# Altium project ZUM_Core.PrjPcb (part 1 of 2)
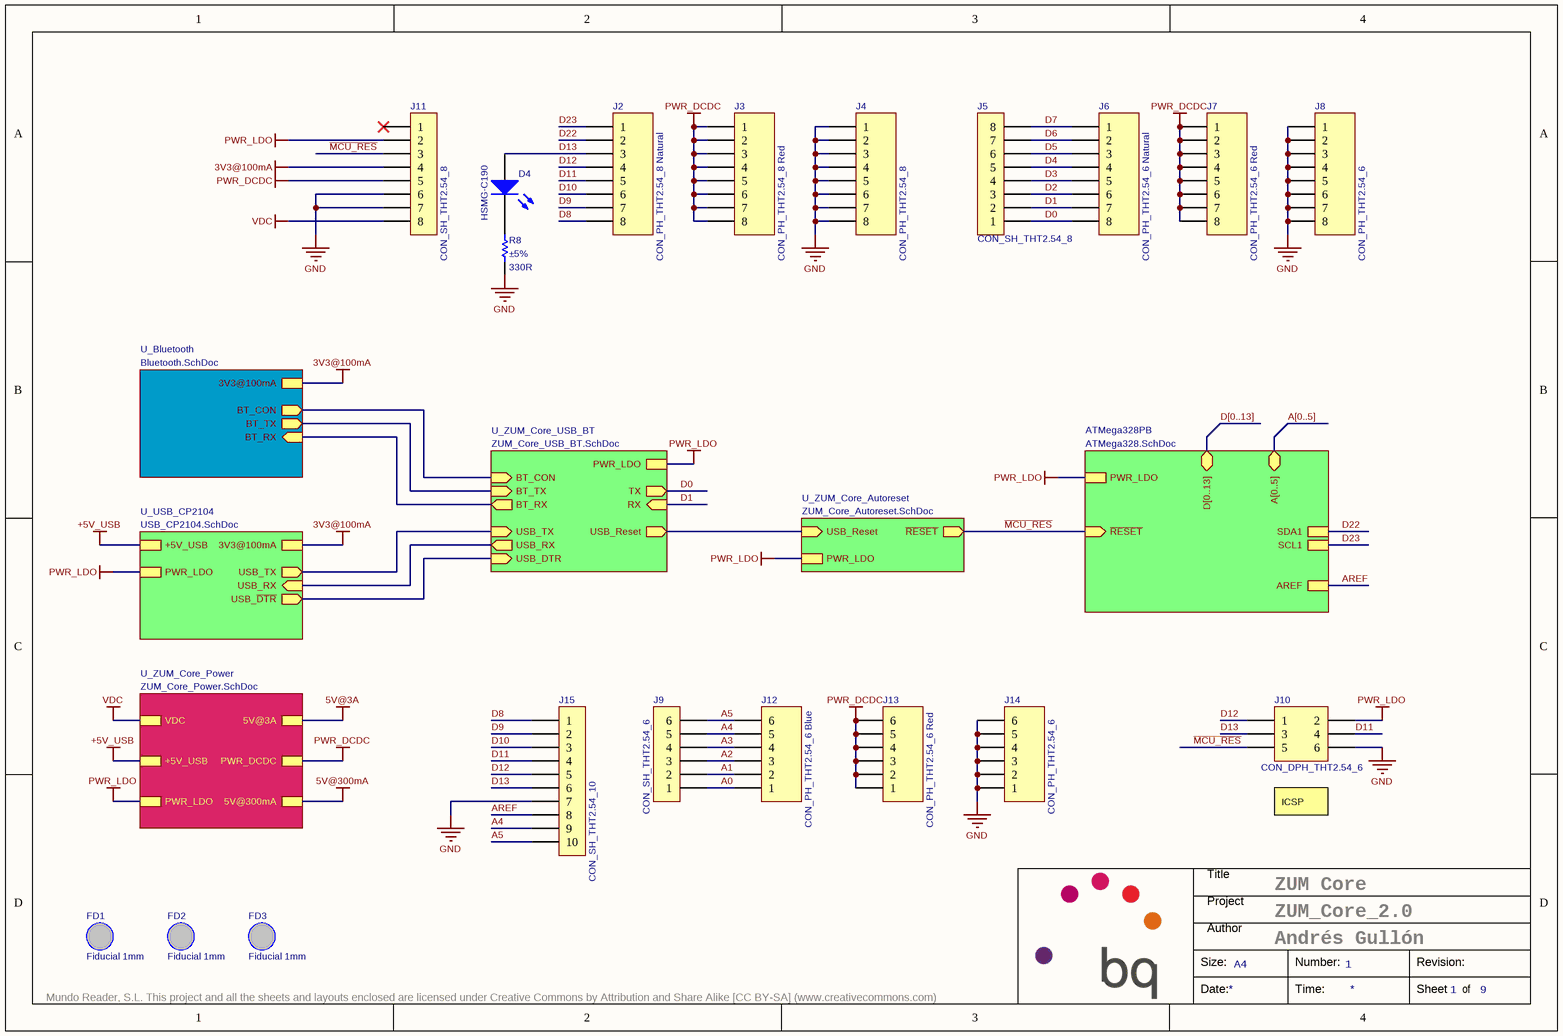
[diagram p0: ZUM_Core.SchDoc]
ItemRevision: 1.I.1; ProjectName: ZUM_Core_2.0; SilkscreenColor: Black; SoldermaskColor: White; SurfaceFinish: HAL / Inmersion TIN / Inmersion Silver
9 sheets, 130 parts. Net scope: hierarchical (ports join the sheet entries above them; power ports are global).
Board file: ZUM_Core.PcbDoc
Sheets:
  ZUM_Core.SchDoc
    ATMega328PB = ATMega328.SchDoc
    U_USB_CP2104 = USB_CP2104.SchDoc
    U_ZUM_Core_Power = ZUM_Core_Power.SchDoc
      U_TPS62133_DCDC_5V = MP1477H_DCDC_5V.SchDoc
      MP2019_LDO_5V = MP2019_LDO_5V.SchDoc
    U_ZUM_Core_USB_BT = ZUM_Core_USB_BT.SchDoc
    U_ZUM_Core_Autoreset = ZUM_Core_Autoreset.SchDoc
    U_Bluetooth = Bluetooth.SchDoc

## Sheet ZUM_Core.SchDoc: ZUM Core
size A4; Author: Andrés Gullón; DocumentNumber: 1; SheetNumber: 1; SheetTotal: 9

### Parts
D4  HSMG-C190  [LED0603]
FD1  Fiducial 1mm  [Fiducial_1mm]  (no BOM)
FD2  Fiducial 1mm  [Fiducial_1mm]  (no BOM)
FD3  Fiducial 1mm  [Fiducial_1mm]  (no BOM)
J2  CON_PH_THT2.54_8 Natural  [1x8 Pin Header 2.54]
J3  CON_PH_THT2.54_8 Red  [1x8 Pin Header 2.54]
J4  CON_PH_THT2.54_8  [1x8 Pin Header 2.54]
J5  CON_SH_THT2.54_8  [1x8 Socket Header THT 2.54mm]
J6  CON_PH_THT2.54_6 Natural  [1x8 Header 2.54 (3D Mod)]
J7  CON_PH_THT2.54_6 Red  [1x8 Header 2.54 (3D Mod)]
J8  CON_PH_THT2.54_6  [1x8 Header 2.54 (3D Mod)]
J9  CON_SH_THT2.54_6  [1x6 Socket Header THT 2.54mm]
J10  CON_DPH_THT2.54_6  [2x3 Pin Header 2.54]
J11  CON_SH_THT2.54_8  [1x8 Socket Header THT 2.54mm]
J12  CON_PH_THT2.54_6 Blue  [1x6 Pin Header 2.54]
J13  CON_PH_THT2.54_6 Red  [1x6 Pin Header 2.54]
J14  CON_PH_THT2.54_6  [1x6 Pin Header 2.54]
J15  CON_SH_THT2.54_10  [1x10 Socket Header THT 2.54mm]
R8  Tolerance: ±5%  Resistance: 330R  [R0402]  (hidden comment: R0402_330R_0.063W_±5%)

### Sub-sheets
ATMega328PB = ATMega328.SchDoc: D[0..13] (bidir), A[0..5] (bidir), ~{RESET} (in), PWR_LDO, AREF, SDA1, SCL1
U_Bluetooth = Bluetooth.SchDoc: 3V3@100mA, BT_TX (out), BT_RX (in), BT_CON (out)
U_USB_CP2104 = USB_CP2104.SchDoc: USB_~{DTR} (out), USB_TX (out), USB_RX (in), +5V_USB, 3V3@100mA, PWR_LDO
U_ZUM_Core_Autoreset = ZUM_Core_Autoreset.SchDoc: ~{RESET} (out), USB_Reset (in), PWR_LDO
U_ZUM_Core_Power = ZUM_Core_Power.SchDoc: VDC, 5V@3A, +5V_USB, PWR_DCDC, 5V@300mA, PWR_LDO
U_ZUM_Core_USB_BT = ZUM_Core_USB_BT.SchDoc: TX (out), RX (in), USB_RX (out), BT_RX (out), USB_TX (in), BT_TX (in), USB_DTR (in), BT_CON (in), PWR_LDO, USB_Reset (out)

### Nets
3V3@100mA: J11.4 ; sheet U_USB_CP2104/3V3@100mA, sheet U_Bluetooth/3V3@100mA
+5V_USB: sheet U_USB_CP2104/+5V_USB, sheet U_ZUM_Core_Power/+5V_USB
GND: J4.1 J4.2 J4.3 J4.4 J4.5 J4.6 J4.7 J4.8 J8.1 J8.2 J8.3 J8.4 J8.5 J8.6 J8.7 J8.8 J10.6 J11.6 J11.7 J14.1 J14.2 J14.3 J14.4 J14.5 J14.6 J15.7 R8.1
PWR_DCDC: J3.1 J3.2 J3.3 J3.4 J3.5 J3.6 J3.7 J3.8 J7.1 J7.2 J7.3 J7.4 J7.5 J7.6 J7.7 J7.8 J11.5 J13.1 J13.2 J13.3 J13.4 J13.5 J13.6 ; sheet U_ZUM_Core_Power/PWR_DCDC
PWR_LDO: J10.2 J11.2 ; sheet ATMega328PB/PWR_LDO, sheet U_USB_CP2104/PWR_LDO, sheet U_ZUM_Core_Power/PWR_LDO, sheet U_ZUM_Core_USB_BT/PWR_LDO, sheet U_ZUM_Core_Autoreset/PWR_LDO
VDC: J11.8 ; sheet U_ZUM_Core_Power/VDC
A0: J9.1 J12.1
A1: J9.2 J12.2
A2: J9.3 J12.3
A3: J9.4 J12.4
A4: J9.5 J12.5 J15.9
A5: J9.6 J12.6 J15.10
AREF: J15.8 ; sheet ATMega328PB/AREF
BT_RX: sheet U_ZUM_Core_USB_BT/BT_RX, sheet U_Bluetooth/BT_RX
BT_TX: sheet U_ZUM_Core_USB_BT/BT_TX, sheet U_Bluetooth/BT_TX
D0: J5.1 J6.8 ; sheet U_ZUM_Core_USB_BT/TX
D1: J5.2 J6.7 ; sheet U_ZUM_Core_USB_BT/RX
D2: J5.3 J6.6
D3: J5.4 J6.5
D4: J5.5 J6.4
D5: J5.6 J6.3
D6: J5.7 J6.2
D7: J5.8 J6.1
D8: J2.8 J15.1
D9: J2.7 J15.2
D10: J2.6 J15.3
D11: J2.5 J10.4 J15.4
D12: J2.4 J10.1 J15.5
D13: D4.A J2.3 J10.3 J15.6
D22: J2.2 ; sheet ATMega328PB/SDA1
D23: J2.1 ; sheet ATMega328PB/SCL1
~{MCU_RES}: J10.5 J11.3 ; sheet ATMega328PB/~{RESET}, sheet U_ZUM_Core_Autoreset/~{RESET}
USB_~{DTR}: sheet U_USB_CP2104/USB_~{DTR}, sheet U_ZUM_Core_USB_BT/USB_DTR
USB_Reset: sheet U_ZUM_Core_USB_BT/USB_Reset, sheet U_ZUM_Core_Autoreset/USB_Reset
USB_RX: sheet U_USB_CP2104/USB_RX, sheet U_ZUM_Core_USB_BT/USB_RX
USB_TX: sheet U_USB_CP2104/USB_TX, sheet U_ZUM_Core_USB_BT/USB_TX
NetD4_K: D4.K R8.2
NetR22_1: sheet U_ZUM_Core_USB_BT/BT_CON, sheet U_Bluetooth/BT_CON

Not connected (* = marked no-connect by the designer): J11 1*

### Buses and harness runs
bus A[0..5] = sheet ATMega328PB/A[0..5]
bus D[0..13] = sheet ATMega328PB/D[0..13]

### Notes on the sheet
- (near J10) ICSP
- Title
- Project
- Size:
- Author
- A4
- Number:
- Revision:
- Mundo Reader, S.L. This project and all the sheets and layouts enclosed are licensed under Creative Commons by Attribution and Share Alike [CC BY-SA] (www.creativecommons.com)
- Date:
- Time:
- Sheet
- of

### Library data of the parts
D4 = CMP-A2544-1: LED; Manufacturer: Avago Technologies; Temp_ Max: 85; Temp_ Min: -40; OrderingCode 2: LG Q971-KN-1; Value: Green; SchLibComponentName: LED; Part Number: HSMG-C190; OrderingCode: HSMG-C190; Description ES: LED; Price units: EUR; Manufacturer 2: OSRAM Opto
FD1-FD3 = CMP-A2525-2: Fiducial; Description ES: Marca fiducial; SchLibComponentName: Fiducial; Part Number: Fiducial 1mm
J2 = CMP-A2144-1: Connector; Manufacturer: Samtec; SchLibComponentName: 1x8 pin Header 2.54mm; Pitch: 2.54mm; OrderingCode: TSW-108-07-T-S-NATURAL; Description ES: Conector; Temp_ Max: 105; Temp_ Min: -55; Part Number: CON_PH_THT2.54_8 Natural; Supplier: Samtec; Supplier cod: AC1238; Price units: EUR
J3 = CMP-A2145-1: Connector; Manufacturer: Samtec; SchLibComponentName: 1x8 pin Header 2.54mm; Pitch: 2.54mm; OrderingCode: TSW-108-07-T-S-RED; Description ES: Conector; Temp_ Max: 105; Temp_ Min: -55; Part Number: CON_PH_THT2.54_8 Red; Supplier: Samtec; Supplier cod: AC1238; Price units: EUR
J4 = CMP-A2142-1: Connector; Manufacturer: Samtec; SchLibComponentName: 1x8 pin Header 2.54mm; Pitch: 2.54mm; OrderingCode: TSW-108-07-T-S; Description ES: Conector; Temp_ Max: 105; Temp_ Min: -55; OrderingCode 2: 613 008 111 21; Value: 8; Part Number: CON_PH_THT2.54_8; Supplier: Samtec; Supplier cod: AC1238; Price units: EUR; Manufacturer 2: Würth Elektronik
J5 J11 = CMP-A2195-1: Connector; Manufacturer: Samtec; Pitch: 2.54mm; OrderingCode: SSW-108-01-T-S; Description ES: Conector; Temp_ Max: 125; Temp_ Min: -40; OrderingCode 2: 613 008 118 21; Value: 8; SchLibComponentName: 1x8 Socket Header 2.54mm; Part Number: CON_SH_THT2.54_8; Supplier: Samtec; Supplier cod: AC1238; Price units: EUR; Manufacturer 2: Würth Elektronik
J6 = CMP-00382-1: Connector; Manufacturer: Samtec; SchLibComponentName: 1x6 pin Header 2.54mm; Pitch: 2.54mm; OrderingCode: TSW-106-07-T-S-NATURAL; Description ES: Conector; Temp_ Max: 105; Temp_ Min: -55; Part Number: CON_PH_THT2.54_6 Natural; Supplier: Samtec; Supplier cod: AC1238; Price units: EUR
J7 = CMP-00380-2: Connector; Manufacturer: Samtec; SchLibComponentName: 1x6 pin Header 2.54mm; Pitch: 2.54mm; OrderingCode: TSW-106-07-T-S-RED; Description ES: Conector; Temp_ Max: 105; Temp_ Min: -55; Part Number: CON_PH_THT2.54_6 Red; Supplier: Samtec; Supplier cod: AC1238; Price units: EUR
J8 = CMP-00381-1: Connector; Manufacturer: Samtec; SchLibComponentName: 1x6 pin Header 2.54mm; Pitch: 2.54mm; OrderingCode: TSW-106-07-T-S; Description ES: Conector; Temp_ Max: 105; Temp_ Min: -55; OrderingCode 2: 613 006 111 21; Value: 6; Part Number: CON_PH_THT2.54_6; Supplier: Samtec; Supplier cod: AC1238; Price units: EUR; Manufacturer 2: Würth Elektronik
J9 = CMP-A2194-1: Connector; Manufacturer: Samtec; Pitch: 2.54mm; OrderingCode: SSW-106-01-T-S; Description ES: Conector; Temp_ Max: 125; Temp_ Min: -40; OrderingCode 2: 613 006 118 21; Value: 6; SchLibComponentName: 1x6 Socket Header 2.54mm; Part Number: CON_SH_THT2.54_6; Supplier: Samtec; Supplier cod: AC1238; Price units: EUR; Manufacturer 2: Würth Elektronik
J10 = CMP-A2163-1: Connector; Manufacturer: Samtec; SchLibComponentName: 2x3 pin Header 2.54mm; Pitch: 2.54mm; OrderingCode: TSW-103-07-T-D; Description ES: Conector; Temp_ Max: 125; Temp_ Min: -40; OrderingCode 2: 613 006 211 21; Value: 6; Part Number: CON_DPH_THT2.54_6; Supplier: Samtec; Supplier cod: AC1238; Price units: EUR; Manufacturer 2: Würth Elektronik
J12 = CMP-A2139-1: Connector; Manufacturer: Samtec; SchLibComponentName: 1x6 pin Header 2.54mm; Pitch: 2.54mm; OrderingCode: TSW-106-07-T-S-BLUE; Description ES: Conector; Temp_ Max: 105; Temp_ Min: -55; Part Number: CON_PH_THT2.54_6 Blue; Supplier: Samtec; Supplier cod: AC1238; Price units: EUR
J13 = CMP-A2141-1: Connector; Manufacturer: Samtec; SchLibComponentName: 1x6 pin Header 2.54mm; Pitch: 2.54mm; OrderingCode: TSW-106-07-T-S-RED; Description ES: Conector; Temp_ Max: 105; Temp_ Min: -55; Part Number: CON_PH_THT2.54_6 Red; Supplier: Samtec; Supplier cod: AC1238; Price units: EUR
J14 = CMP-A2138-1: Connector; Manufacturer: Samtec; SchLibComponentName: 1x6 pin Header 2.54mm; Pitch: 2.54mm; OrderingCode: TSW-106-07-T-S; Description ES: Conector; Temp_ Max: 105; Temp_ Min: -55; OrderingCode 2: 613 006 111 21; Value: 6; Part Number: CON_PH_THT2.54_6; Supplier: Samtec; Supplier cod: AC1238; Price units: EUR; Manufacturer 2: Würth Elektronik
J15 = CMP-A2189-1: Connector; Manufacturer: Samtec; Pitch: 2.54mm; OrderingCode: SSW-110-01-T-S; Description ES: Conector; Temp_ Max: 125; Temp_ Min: -40; Value: 10; OrderingCode 2: 613 010 118 21; SchLibComponentName: 1x10 Socket Header 2.54mm; Part Number: CON_SH_THT2.54_10; Supplier: Samtec; Supplier cod: AC1238; Price units: EUR; Manufacturer 2: Würth Elektronik
R8 = CMP-A1762-2: Manufacturer: Vishay; SchLibComponentName: Resistor; OrderingCode: CRCW0402330RJN; Power: 0.063W; Value: 330R ±5% 0.063W; Temp_ Max: 155; Temp_ Min: -55; Description ES: Resistencia; PackageDescription: SMD; Part Number: R0402_330R_0.063W_±5%; Price units: EUR

## Sheet ATMega328.SchDoc: ATMega328-PB
size A4; Author: Andrés Gullón; DocumentNumber: 6; SheetNumber: 6; SheetTotal: 9
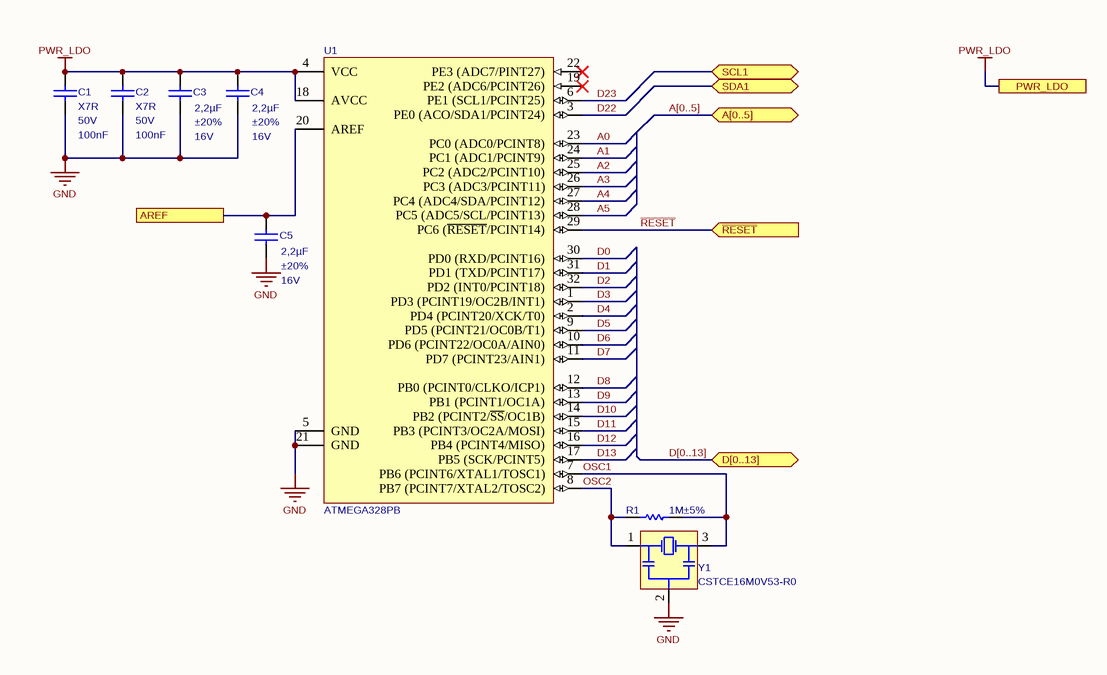
[diagram p1: ATMega328.SchDoc]

### Parts
C1  Dielectric: X7R  Voltage: 50V  Capacitance: 100nF  [C0603]  (hidden comment: C0603_100nF_50V_±10%_X7R)
C2  Dielectric: X7R  Voltage: 50V  Capacitance: 100nF  [C0603]  (hidden comment: C0603_100nF_50V_±10%_X7R)
C3  Voltage: 16V  Capacitance: 2,2µF  Tolerance: ±20%  [C0402]  (hidden comment: C0402_2.2uF_16V_±20%)
C4  Voltage: 16V  Capacitance: 2,2µF  Tolerance: ±20%  [C0402]  (hidden comment: C0402_2.2uF_16V_±20%)
C5  Voltage: 16V  Capacitance: 2,2µF  Tolerance: ±20%  [C0402]  (hidden comment: C0402_2.2uF_16V_±20%)
R1  Tolerance: ±5%  Resistance: 1M  [R0603]  (hidden comment: R0603_1M_0.1W_±5%)
U1  ATMEGA328PB  [TQFP32]
Y1  CSTCE16M0V53-R0  [Resonator_1.3x3.2]

### Ports
A[0..5] (bidir), AREF, D[0..13] (bidir), PWR_LDO, SCL1 (bidir), SDA1 (bidir), ~{RESET} (in)

### Nets
GND: C1.1 C2.1 C3.1 C4.1 C5.1 U1.5(GND) U1.21(GND) Y1.2(GND)
PWR_LDO: C1.2 C2.2 C3.2 C4.2 U1.4(VCC) U1.18(AVCC) ; port PWR_LDO
A0: U1.23(PC0_(ADC0/PCINT8))
A1: U1.24(PC1_(ADC1/PCINT9))
A2: U1.25(PC2_(ADC2/PCINT10))
A3: U1.26(PC3_(ADC3/PCINT11))
A4: U1.27(PC4_(ADC4/SDA/PCINT12))
A5: U1.28(PC5_(ADC5/SCL/PCINT13))
AREF: C5.2 U1.20(AREF) ; port AREF
D0: U1.30(PD0_(RXD/PCINT16))
D1: U1.31(PD1_(TXD/PCINT17))
D2: U1.32(PD2_(INT0/PCINT18))
D3: U1.1(PD3_(PCINT19/OC2B/INT1))
D4: U1.2(PD4_(PCINT20/XCK/T0))
D5: U1.9(PD5_(PCINT21/OC0B/T1))
D6: U1.10(PD6_(PCINT22/OC0A/AIN0))
D7: U1.11(PD7_(PCINT23/AIN1))
D8: U1.12(PB0_(PCINT0/CLKO/ICP1))
D9: U1.13(PB1_(PCINT1/OC1A))
D10: U1.14(PB2_(PCINT2/~{SS}/OC1B))
D11: U1.15(PB3_(PCINT3/OC2A/MOSI))
D12: U1.16(PB4_(PCINT4/MISO))
D13: U1.17(PB5_(SCK/PCINT5))
D22: U1.3(PE0_(ACO/SDA1/PCINT24)) ; port SDA1
D23: U1.6(PE1_(SCL1/PCINT25)) ; port SCL1
OSC1: R1.1 U1.7(PB6_(PCINT6/XTAL1/TOSC1)) Y1.3(OSC2)
OSC2: R1.2 U1.8(PB7_(PCINT7/XTAL2/TOSC2)) Y1.1(OSC1)
~{RESET}: U1.29(PC6_(~{RESET}/PCINT14)) ; port ~{RESET}  [project net ~{MCU_RES}]

Not connected (* = marked no-connect by the designer): U1 19(PE2_(ADC6/PCINT26))* 22(PE3_(ADC7/PINT27))*

### Buses and harness runs
bus A[0..5] = port A[0..5]
bus D[0..13] = port D[0..13]

### Notes on the sheet
- Title
- Project
- Size:
- Author
- A4
- Number:
- Revision:
- Mundo Reader, S.L. This project and all the sheets and layouts enclosed are licensed under Creative Commons by Attribution and Share Alike [CC BY-SA] (www.creativecommons.com)
- Date:
- Time:
- Sheet
- of

### Library data of the parts
C1 C2 = CMP-00257-1: Manufacturer: Kemet; Description ES: Condensador; OrderingCode: C0603C104K5RAC; OrderingCode 2: 06035C104KAT2A; SchLibComponentName: Capacitor; Temp_ Max: 125; Temp_ Min: -55; Tolerance: ±10%; Value: 100nF ±10% 50V; Manufacturer 2: AVX; Part Number: C0603_100nF_50V_±10%_X7R; Price units: EUR
C3-C5 = CMP-A0550-4: C0402_2.2uF_16V_±20%_X5R; Part Number: C0402_2.2uF_16V_±10%; Manufacturer: TDK; Value: 2,2µF ±20% 16V; Dielectric: X5R; OrderingCode: C1005X5R1C225M050BC; Temp_ Max: 125; Temp_ Min: -55; AccessRights: 2147483647; ContentType: Component; Description ES: Condensador; Folder: Components Library\Pasives\Capacitor_SMD\C0402_16V$\; OrderingCode 2: EMK105ABJ225MV-F; RevisionId: 3; SchLibComponentName: Capacitor; Price units: EUR; ComponentType: Capacitor; ContentTypeGUID: CB3C11C4-E317-11DF-B822-12313F0024A2; FolderGUID: B1BE7916-43F7-4918-A273-F24409A7170B; ItemGUID: BD471B44-C1FF-4F80-85CC-AC0CC62DE9EE; ItemHRID: CMP-A0550; LifeCycle: New From Design; LifeCycleStateGUID: 706004B5-C76E-482E-903B-BA0E4FAE086A; Manufacturer 2: Taiyo Yuden; ReleaseDate: 04/09/2017 08:02:11 AM
R1 = CMP-A1358-3: Manufacturer: Vishay; OrderingCode: CRCW06031M00JN; Power: 0.1W; Value: 1M ±5% 0.1W; Temp_ Max: 155; Temp_ Min: -55; Description ES: Resistencia; SchLibComponentName: Resistor; PackageDescription: SMD; Part Number: R0603_1M_0.1W_±5%; Price units: EUR
U1 = CMP-00141-3: 8-bit Microcontrollers - MCU 32KB In-system Flash 20MHz 1.8V-5.5V; Manufacturer: Atmel; OrderingCode: ATMEGA328PB-AU; Description ES: Microcontrolador 8 bits; 32kB de memoria; Temp_ Max: 85; Temp_ Min: -40; SchLibComponentName: ATMEGA328PB; Part Number: ATMEGA328PB; Price units: EUR
Y1 = CMP-A2241-1: Resonator 16MHz; Manufacturer: Murata; Description ES: Resonador 16MHz; Temp_Max: 80; Temp_Min: -20; SchLibComponentName: Resonator 3 pin; Part Number: CSTCE16M0V53-R0; OrderingCode: CSTCE16M0V53-R0; Price units: EUR; Value: 16MHz

## Sheet USB_CP2104.SchDoc: CP2104 USB to Serial
size A4; Author: Andrés Gullón; DocumentNumber: 5; SheetNumber: 5; SheetTotal: 9
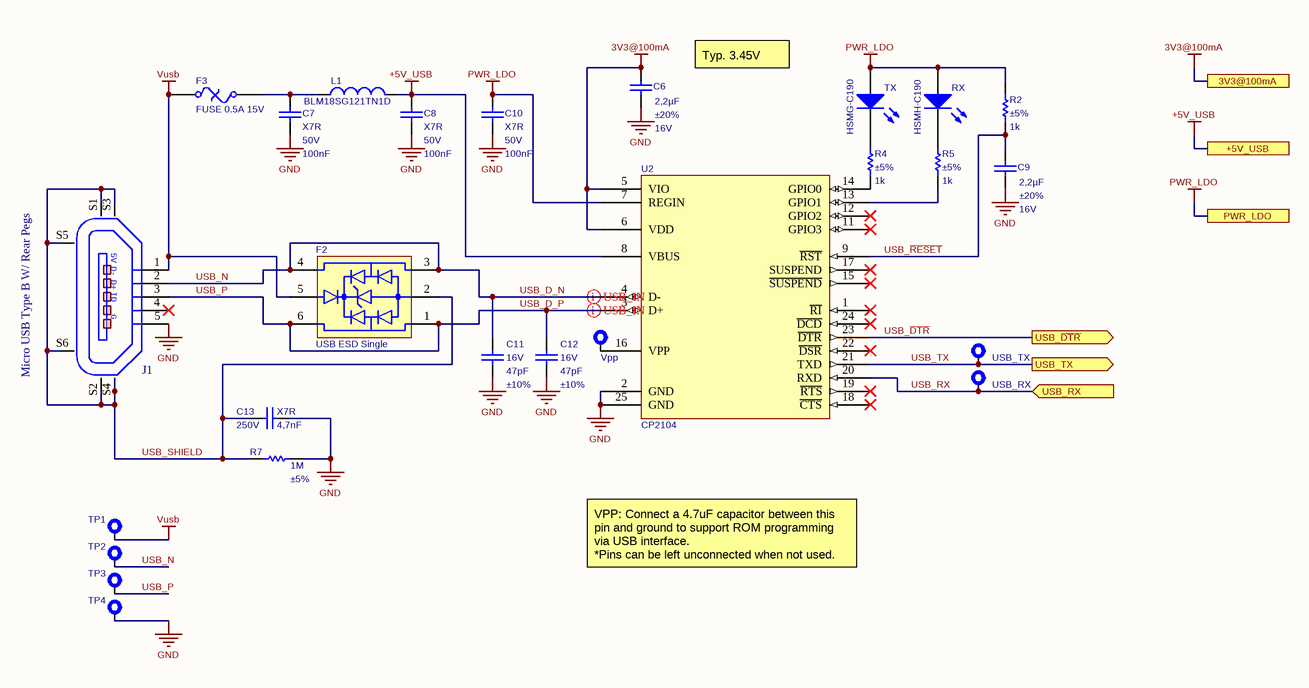
[diagram p2: USB_CP2104.SchDoc]

### Parts
C6  Voltage: 16V  Capacitance: 2,2µF  Tolerance: ±20%  [C0402]  (hidden comment: C0402_2.2uF_16V_±20%)
C7  Dielectric: X7R  Voltage: 50V  Capacitance: 100nF  [C0603]  (hidden comment: C0603_100nF_50V_±10%_X7R)
C8  Dielectric: X7R  Voltage: 50V  Capacitance: 100nF  [C0603]  (hidden comment: C0603_100nF_50V_±10%_X7R)
C9  Voltage: 16V  Capacitance: 2,2µF  Tolerance: ±20%  [C0402]  (hidden comment: C0402_2.2uF_16V_±20%)
C10  Dielectric: X7R  Voltage: 50V  Capacitance: 100nF  [C0603]  (hidden comment: C0603_100nF_50V_±10%_X7R)
C11  Voltage: 16V  Capacitance: 47pF  Tolerance: ±10%  [C0402]  (hidden comment: C0402_47pF_16V_±10%)
C12  Voltage: 16V  Capacitance: 47pF  Tolerance: ±10%  [C0402]  (hidden comment: C0402_47pF_16V_±10%)
C13  Dielectric: X7R  Voltage: 250V  Capacitance: 4,7nF  [C0805]  (hidden comment: C0805_4700pF_250V_±10%_X7R)
F2  USB ESD Single  [SOT563]
F3  FUSE 0.5A 15V  [F1812]
J1  Micro USB Type B W/ Rear Pegs  [USB_B_W_REAR_PEGS]
L1  OrderingCode: BLM18SG121TN1D  [L0603]  (hidden comment: L0603_120R_0,025R_3000mA)
R2  Tolerance: ±5%  Resistance: 1k  [R0402]  (hidden comment: R0402_1k_0.063W_±5%)
R4  Tolerance: ±5%  Resistance: 1k  [R0402]  (hidden comment: R0402_1k_0.063W_±5%)
R5  Tolerance: ±5%  Resistance: 1k  [R0402]  (hidden comment: R0402_1k_0.063W_±5%)
R7  Tolerance: ±5%  Resistance: 1M  [R0603]  (hidden comment: R0603_1M_0.1W_±5%)
RX  HSMH-C190  [LED0603]
TP1  TP  [TP_POWER]  (value not drawn)  (no BOM)
TP2  TP_POWER  [TP_POWER]  (value not drawn)  (no BOM)
TP3  TP_POWER  [TP_POWER]  (value not drawn)  (no BOM)
TP4  TP_POWER  [TP_POWER]  (value not drawn)  (no BOM)
TX  HSMG-C190  [LED0603]
U2  CP2104  [QFN24_no_power]
USB_RX  TP_POWER  [TP_POWER]  (value not drawn)  (no BOM)
USB_TX  TP_POWER  [TP_POWER]  (value not drawn)  (no BOM)
Vpp  TP_POWER  [TP_POWER]  (value not drawn)  (no BOM)

### Ports
3V3@100mA, +5V_USB, PWR_LDO, USB_RX (in), USB_TX (out), USB_~{DTR} (out)

### Nets
3V3@100mA: C6.2 U2.5(VIO) U2.6(VDD) ; port 3V3@100mA
+5V_USB: C8.2 L1.2 U2.8(VBUS) ; port +5V_USB
GND: C6.1 C7.1 C8.1 C9.1 C10.1 C11.1 C12.1 C13.2 J1.5(P5) R7.1 TP4.1 U2.2(GND) U2.25(GND)
PWR_LDO: C10.2 R2.2 RX.A TX.A U2.7(REGIN) ; port PWR_LDO
Vusb: F2.5 F3.1 J1.1(P1) TP1.1
USB_~{DTR}: U2.23(~{DTR}) ; port USB_~{DTR}
USB_D_N: C11.2 F2.3 F2.4 J1.2(P2) TP2.1 U2.4(D-)  [also labelled USB_N]
USB_D_P: C12.2 F2.1 F2.6 J1.3(P3) TP3.1 U2.3(D+)  [also labelled USB_P]
USB_~{RESET}: C9.2 R2.1 U2.9(~{RST})
USB_RX: U2.20(RXD) USB_RX.1 ; port USB_RX
USB_SHIELD: C13.1 F2.2 J1.S1(SHLD1) J1.S2(SHLD2) J1.S3(SHLD3) J1.S4(SHLD4) J1.S5(SHLD5) J1.S6(SHLD6) R7.2
USB_TX: U2.21(TXD) USB_TX.1 ; port USB_TX
NetC7_2: C7.2 F3.2 L1.1
NetR4_1: R4.1 U2.14(GPIO0)
NetR4_2: R4.2 TX.K
NetR5_1: R5.1 U2.13(GPIO1)
NetR5_2: R5.2 RX.K
NetU2_16: U2.16(VPP) Vpp.1

Not connected (* = marked no-connect by the designer): J1 4(P4)*; U2 1(~{RI})* 11(GPIO3)* 12(GPIO2)* 15(~{SUSPEND})* 17(SUSPEND)* 18(~{CTS})* 19(~{RTS})* 22(~{DSR})* 24(~{DCD})*

### Layout directives
differential pair: USB_D_N, USB_D_P

### Notes on the sheet
- Typ. 3.45V
- VPP: Connect a 4.7uF capacitor between this pin and ground to support ROM programming via USB interface.
  *Pins can be left unconnected when not used.
- Title
- Project
- Size:
- Author
- A4
- Number:
- Revision:
- Mundo Reader, S.L. This project and all the sheets and layouts enclosed are licensed under Creative Commons by Attribution and Share Alike [CC BY-SA] (www.creativecommons.com)
- Date:
- Time:
- Sheet
- of
- (in symbol CMP-A2224-4) 5V; D-; D+; ID; G

### Library data of the parts
C6 C9 = CMP-A0550-4: as C3 on sheet ATMega328; SchLibComponentName: Capacitor; Price units: EUR; ComponentType: Capacitor; ContentTypeGUID: CB3C11C4-E317-11DF-B822-12313F0024A2; FolderGUID: B1BE7916-43F7-4918-A273-F24409A7170B; ItemGUID: BD471B44-C1FF-4F80-85CC-AC0CC62DE9EE; ItemHRID: CMP-A0550; LifeCycle: New From Design; LifeCycleStateGUID: 706004B5-C76E-482E-903B-BA0E4FAE086A; Manufacturer 2: Taiyo Yuden; ReleaseDate: 04/09/2017 08:02:11 AM
C7 C8 C10 = CMP-00257-1: as C1 on sheet ATMega328; Manufacturer 2: AVX; Part Number: C0603_100nF_50V_±10%_X7R; Price units: EUR
C11 C12 = CMP-A0572-2: Manufacturer: Kemet; Value: 47pF ±10% 16V; Dielectric: C0G; OrderingCode: C0402C470K4GAC; Temp_ Max: 125; Temp_ Min: -55; AccessRights: 2147483647; ContentType: Component; Description ES: Condensador; Folder: Components Library\Pasives\Capacitor_SMD\C0402_16V$\; RevisionId: 1; SchLibComponentName: Capacitor; Part Number: C0402_47pF_16V_±10%; Price units: EUR; ComponentType: Capacitor; ContentTypeGUID: CB3C11C4-E317-11DF-B822-12313F0024A2; FolderGUID: B1BE7916-43F7-4918-A273-F24409A7170B; ItemGUID: BA17F97B-A8F2-4344-A89B-4AB43394B9E9; ItemHRID: CMP-A0572; LifeCycle: New From Design; LifeCycleStateGUID: 706004B5-C76E-482E-903B-BA0E4FAE086A; ReleaseDate: 19/02/2016 10:21:00 AM
C13 = CMP-00357-1: Manufacturer: Kemet; Description ES: Condensador; OrderingCode: C0805S472KARACTU; OrderingCode 2: GRM21AR72E472KW01D; SchLibComponentName: Capacitor; Temp_ Max: 125; Temp_ Min: -55; Tolerance: ±10%; Value: 4,7nF ±10% 250V; Manufacturer 2: Murata; Price units: EUR
F2 = CMP-A2443-2: TVS Diode Array; Manufacturer: Würth Elektronik; OrderingCode: 82400152; Description ES: Array de diodos TVS; Temp_ Max: 125; Temp_ Min: -40; OrderingCode 2: CDSOT563-0502; SchLibComponentName: ESDUSB; Part Number: USB ESD Single; Supplier: Würth Elektronik; Price units: EUR; Manufacturer 2: Bourns
F3 = CMP-A2421-1: Resettable Fuses; Manufacturer: Bourns; OrderingCode: MF-MSMF050-2; Description ES: Fusible reseteable; Temp_ Max: 85; Temp_ Min: -40; SchLibComponentName: PTC_Fuse; Part Number: FUSE 0.5A 15V; Voltage: 15V; Current: 0.5A; Price units: EUR
J1 = CMP-A2224-4: Manufacturer: FCI; OrderingCode: 10118194-0001LF; Description ES: Conector; Temp_ Max: 105; Temp_ Min: -40; SchLibComponentName: USB_Micro_Type_B; Part Number: Micro USB Type B W/ Rear Pegs; Price units: EUR
L1 = CMP-A0708-2: Manufacturer: Murata; Resistance_100MHz: 120R; Resistance_DC: 0,025R; Current: 3000mA; Temp_ Max: 125; Temp_ Min: -55; Value: 120R 0,025R 3000mA; Description ES: Ferrita; SchLibComponentName: Ferrite Bead; Part Number: L0603_120R_0,025R_3000mA; Price units: EUR
R2 R4 R5 = CMP-A1718-3: Manufacturer: Vishay; OrderingCode: CRCW04021K00JN; Power: 0.063W; Value: 1k ±5% 0.063W; Temp_ Max: 155; Temp_ Min: -55; Description ES: Resistencia; SchLibComponentName: Resistor; PackageDescription: SMD; Part Number: R0402_1k_0.063W_±5%; Price units: EUR
R7 = CMP-A1358-3: as R1 on sheet ATMega328; SchLibComponentName: Resistor; PackageDescription: SMD; Part Number: R0603_1M_0.1W_±5%; Price units: EUR
RX = CMP-A2546-1: LED; Manufacturer: Avago Technologies; Temp_ Max: 85; Temp_ Min: -40; OrderingCode 2: LS Q976-NR-1; Value: Red; SchLibComponentName: LED; Part Number: HSMH-C190; OrderingCode: HSMH-C190; Description ES: LED; Price units: EUR; Manufacturer 2: OSRAM Opto
TP1-TP4 USB_RX USB_TX Vpp = CMP-A2499-3: Testpoint 0.3mm; Manufacturer: Oxley; OrderingCode: SMOX/060/B1; SAP: 303552; SchLibComponentName: Testpoint; Part Number: TP_POWER; Price units: EUR
TX = CMP-A2544-1: as D4 on sheet ZUM_Core; SchLibComponentName: LED; Part Number: HSMG-C190; OrderingCode: HSMG-C190; Description ES: LED; Price units: EUR; Manufacturer 2: OSRAM Opto
U2 = CMP-A2587-1: USB to UART Bridge; Manufacturer: Silicon Labs; OrderingCode: CP2104-F03-GMR; Description ES: Interfaz USB a UART; Temp_ Max: 85; Temp_ Min: -40; SchLibComponentName: CP2104; Part Number: CP2104; Supplier: Silica; Supplier cod: AC1190; Price units: EUR

## Sheet ZUM_Core_Power.SchDoc: ZUM Core Power
size A4; Author: Andrés Gullón; DocumentNumber: 2; SheetNumber: 2; SheetTotal: 9
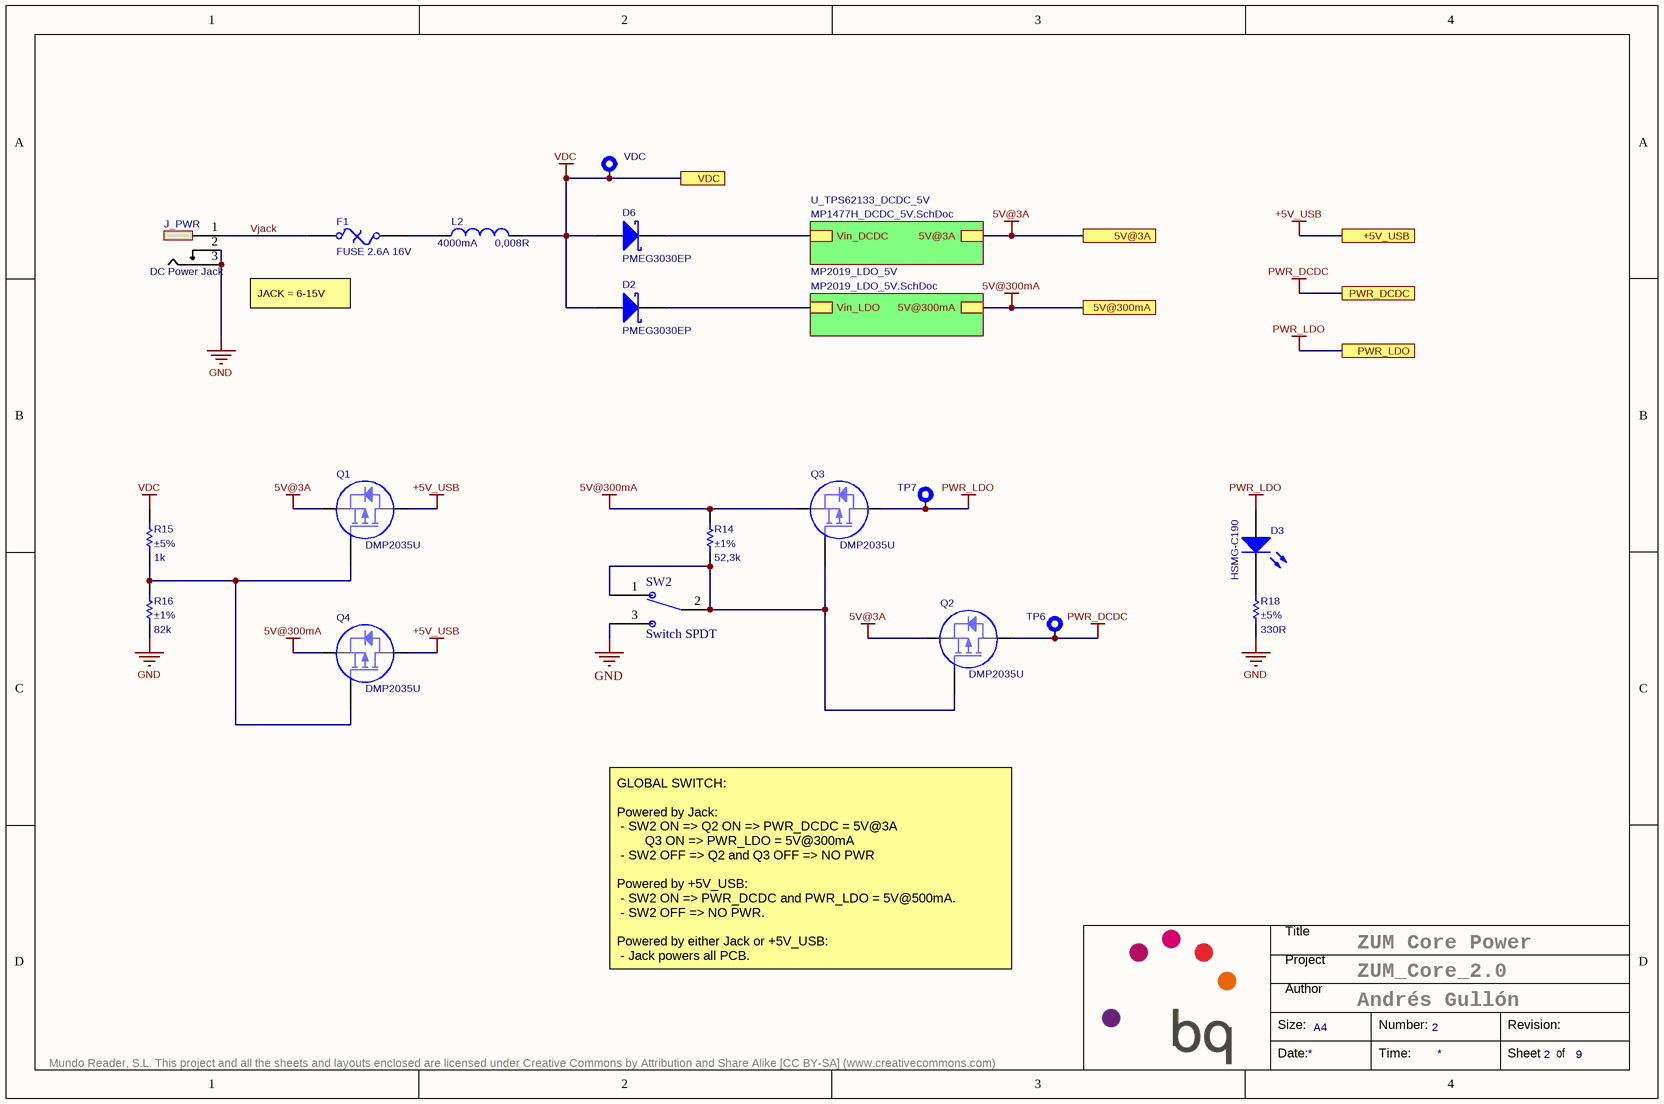
[diagram p3: ZUM_Core_Power.SchDoc]

### Parts
D2  PMEG3030EP  [SOD128]
D3  HSMG-C190  [LED0603]
D6  PMEG3030EP  [SOD128]
F1  FUSE 2.6A 16V  [F1812]
J_PWR  DC Power Jack  [Jack 2.1]
L2  Resistance_DC: 0,008R  Current: 4000mA  [L0805]  (hidden comment: L0805_33R_0,008R_4000mA)
Q1  DMP2035U  [SOT23-3]
Q2  DMP2035U  [SOT23-3]
Q3  DMP2035U  [SOT23-3]
Q4  DMP2035U  [SOT23-3]
R14  Tolerance: ±1%  Resistance: 52,3k  [R0402]  (hidden comment: R0402_52,3k_0.063W_±1%)
R15  Tolerance: ±5%  Resistance: 1k  [R0402]  (hidden comment: R0402_1k_0.063W_±5%)
R16  Tolerance: ±1%  Resistance: 82k  [R0402]  (hidden comment: R0402_82k_0.063W_±1%)
R18  Tolerance: ±5%  Resistance: 330R  [R0402]  (hidden comment: R0402_330R_0.063W_±5%)
SW2  Switch SPDT  [Slide SW SPDT Right Angle]
TP6  TP  [TP_POWER]  (value not drawn)  (no BOM)
TP7  TP  [TP_POWER]  (value not drawn)  (no BOM)
VDC  TP_POWER  [TP_POWER]  (value not drawn)  (no BOM)

### Sub-sheets
MP2019_LDO_5V = MP2019_LDO_5V.SchDoc: 5V@300mA, Vin_LDO
U_TPS62133_DCDC_5V = MP1477H_DCDC_5V.SchDoc: Vin_DCDC, 5V@3A

### Ports
5V@3A, 5V@300mA, +5V_USB, PWR_DCDC, PWR_LDO, VDC

### Nets
5V@3A: Q1.2(S) Q2.2(S) ; port 5V@3A, sheet U_TPS62133_DCDC_5V/5V@3A
5V@300mA: Q3.2(S) Q4.2(S) R14.1 ; port 5V@300mA, sheet MP2019_LDO_5V/5V@300mA
+5V_USB: Q1.3(D) Q4.3(D) ; port +5V_USB
GND: J_PWR.2 J_PWR.3 R16.1 R18.1 SW2.3
PWR_DCDC: Q2.3(D) TP6.1 ; port PWR_DCDC
PWR_LDO: D3.A Q3.3(D) TP7.1 ; port PWR_LDO
VDC: D2.A D6.A L2.2 R15.2 VDC.1 ; port VDC
Vin_DCDC: D6.k(K) ; sheet U_TPS62133_DCDC_5V/Vin_DCDC
Vjack: F1.1 J_PWR.1
NetC31_1: D2.k(K) ; sheet MP2019_LDO_5V/Vin_LDO
NetD3_K: D3.K R18.2
NetF1_2: F1.2 L2.1
NetQ1_1: Q1.1(G) Q4.1(G) R15.1 R16.2
NetQ2_1: Q2.1(G) Q3.1(G) R14.2 SW2.1 SW2.2

### Notes on the sheet
- JACK = 6-15V
- GLOBAL SWITCH:
  Powered by Jack:
  - SW2 ON => Q2 ON => PWR_DCDC = 5V@3A
  Q3 ON => PWR_LDO = 5V@300mA
  - SW2 OFF => Q2 and Q3 OFF => NO PWR
  Powered by +5V_USB:
  - SW2 ON => PWR_DCDC and PWR_LDO = 5V@500mA.
  - SW2 OFF => NO PWR.
  Powered by either Jack or +5V_USB:
  - Jack powers all PCB.
- Title
- Project
- Size:
- Author
- A4
- Number:
- Revision:
- Mundo Reader, S.L. This project and all the sheets and layouts enclosed are licensed under Creative Commons by Attribution and Share Alike [CC BY-SA] (www.creativecommons.com)
- Date:
- Time:
- Sheet
- of

### Library data of the parts
D2 D6 = CMP-A2309-1: Schottky Diode; Manufacturer: NXP; Ifor: 3A; Vrrm: 30V; Ifsm: 50A; Vf: 0,36V; Description ES: Diodo Schottky; Temp_Max: 150; Temp_Min: -55; Value: 3A 30V; SchLibComponentName: Schottky; Part Number: PMEG3030EP; OrderingCode: PMEG3030EP; Price units: EUR
D3 = CMP-A2544-1: as D4 on sheet ZUM_Core; SchLibComponentName: LED; Part Number: HSMG-C190; OrderingCode: HSMG-C190; Description ES: LED; Price units: EUR; Manufacturer 2: OSRAM Opto
F1 = CMP-A2427-2: Resettable Fuses; Part Number: FUSE 2.5A 16V; Manufacturer: Bel Fuse; SchLibComponentName: PTC_Fuse; Current: 2.5A; OrderingCode: 0ZCG0260BF2B; Description ES: Fusible reseteable; Temp_ Max: 85; Temp_ Min: -40; OrderingCode 2: MINISMDC260F/16-2; OrderingCode 3: MF-MSMF250/16X-2; Voltage: 16V; Price units: EUR; Manufacturer 2: Littelfuse; Manufacturer 3: Bourns
J_PWR = CMP-A2063-2: Connector; Manufacturer: Kycon; Idc: 5A; OrderingCode: KLDHCX0202A; Description ES: Conector; OrderingCode 2: RAPC722X; SchLibComponentName: Power_Jack; Part Number: DC Power Jack; Supplier cod: AC1190; Price units: EUR; Manufacturer 2: Switchcraft
L2 = CMP-A0714-1: Manufacturer: Würth Elektronik; SchLibComponentName: Ferrite Bead; Resistance_100MHz: 33R; OrderingCode: 742792012; Temp_ Max: 125; Temp_ Min: -55; Value: 33R 0,008R 4000mA; Part Number: L0805_33R_0,008R_4000mA; Price units: EUR
Q1-Q4 = CMP-A2378-1: P-MOSFET transistor; Manufacturer: Diodes Incorporated; SchLibComponentName: Mosfet_P; Vds: 20V; Vgss: 8V; Id: 3,6A; OrderingCode: DMP2035U-7; Description ES: Transistor MOSFET de canal P; Temp_ Max: 150; Temp_ Min: -55; Part Number: DMP2035U; Supplier cod: AC1190; Price units: EUR
R14 = CMP-A1961-1: Manufacturer: Vishay; Value: 52,3k ±1% 0.063W; OrderingCode: CRCW040252K3FK; Power: 0.063W; Temp_ Max: 155; Temp_ Min: -55; SchLibComponentName: Resistor; PackageDescription: SMD; Part Number: R0402_52,3k_0.063W_±1%; Price units: EUR
R15 = CMP-A1718-3: as R2 on sheet USB_CP2104; SchLibComponentName: Resistor; PackageDescription: SMD; Part Number: R0402_1k_0.063W_±5%; Price units: EUR
R16 = CMP-A1992-3: Manufacturer: Vishay; OrderingCode: CRCW040282K0FK; Power: 0.063W; Value: 82k ±1% 0.063W; Temp_ Max: 155; Temp_ Min: -55; Description ES: Resistencia; OrderingCode 2: RC0402FR-0782KL; SchLibComponentName: Resistor; PackageDescription: SMD; Part Number: R0402_82k_0.063W_±1%; Price units: EUR; Manufacturer 2: Yageo
R18 = CMP-A1762-2: as R8 on sheet ZUM_Core; PackageDescription: SMD; Part Number: R0402_330R_0.063W_±5%; Price: 0,003; Price units: EUR; Supplier: Abacus
SW2 = CMP-A2473-1: Switch; Manufacturer: Würth Elektronik; SchLibComponentName: SPDT Switch; OrderingCode: 450 302 014 072; Description ES: Micro interruptor; Temp_ Max: 85; Temp_ Min: -40; OrderingCode 2: MMP1010D-RA; Part Number: Switch SPDT; Supplier: Würth; Price units: EUR; Manufacturer 2: Knitter-Switch
TP6 TP7 VDC = CMP-A2499-3: as TP1 on sheet USB_CP2104; SchLibComponentName: Testpoint; Part Number: TP_POWER; Price units: EUR

## Sheet MP1477H_DCDC_5V.SchDoc: MP1477H DCDC 5V@3A
size A4; Author: Andrés Gullón; DocumentNumber: 4; SheetNumber: 4; SheetTotal: 9
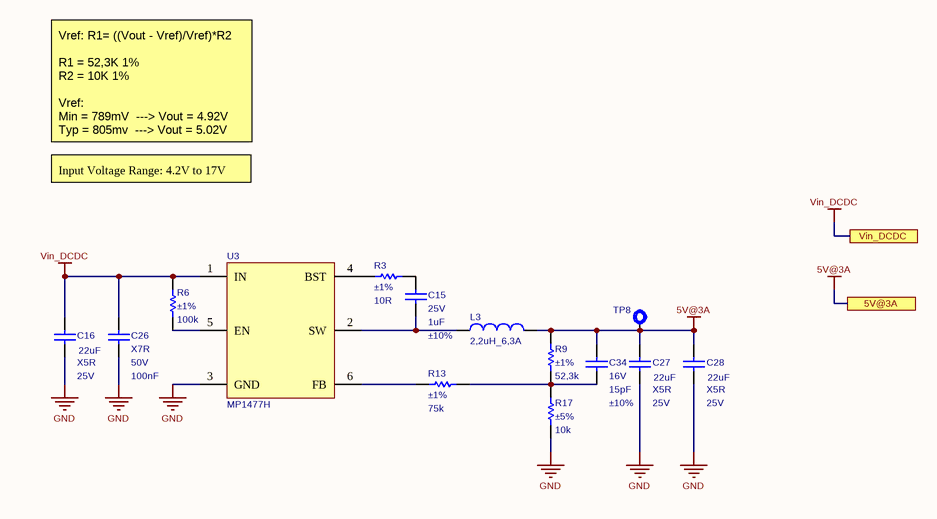
[diagram p4: MP1477H_DCDC_5V.SchDoc]

### Parts
C15  Voltage: 25V  Capacitance: 1uF  Tolerance: ±10%  [C0603]  (hidden comment: C0603_1uF_25V_±10%)
C16  Dielectric: X5R  Voltage: 25V  Capacitance: 22uF  [C1206]  (hidden comment: C1206_22uF_25V_±10%)
C26  Dielectric: X7R  Voltage: 50V  Capacitance: 100nF  [C0603]  (hidden comment: C0603_100nF_50V_±10%_X7R)
C27  Dielectric: X5R  Voltage: 25V  Capacitance: 22uF  [C1206]  (hidden comment: C1206_22uF_25V_±10%)
C28  Dielectric: X5R  Voltage: 25V  Capacitance: 22uF  [C1206]  (hidden comment: C1206_22uF_25V_±10%)
C34  Voltage: 16V  Capacitance: 15pF  Tolerance: ±10%  [C0402]  (hidden comment: C0402_15pF_16V_±10%_C0G)
L3  2,2uH_6,3A  [SRN8040]
R3  Tolerance: ±1%  Resistance: 10R  [R0402]  (hidden comment: R0402_10R_0.063W_±1%)
R6  Tolerance: ±1%  Resistance: 100k  [R0402]  (hidden comment: R0402_100k_0.063W_±1%)
R9  Tolerance: ±1%  Resistance: 52,3k  [R0402]  (hidden comment: R0402_52,3k_0.063W_±1%)
R13  Tolerance: ±1%  Resistance: 75k  [R0402]  (hidden comment: R0402_75k_0.063W_±1%)
R17  Tolerance: ±5%  Resistance: 10k  [R0402]  (hidden comment: R0402_10k_0.063W_±5%)
TP8  TP  [TP_POWER]  (value not drawn)  (no BOM)
U3  MP1477H  [SOT-563 - MP1477H]

### Ports
5V@3A, Vin_DCDC

### Nets
5V@3A: C27.2 C28.2 C34.2 L3.2 R9.1 TP8.1 ; port 5V@3A
GND: C16.1 C26.1 C27.1 C28.1 R17.2 U3.3(GND)
Vin_DCDC: C16.2 C26.2 R6.2 U3.1(IN) ; port Vin_DCDC
NetC15_1: C15.1 L3.1 U3.2(SW)
NetC15_2: C15.2 R3.2
NetC34_1: C34.1 R9.2 R13.2 R17.1
NetR3_1: R3.1 U3.4(BST)
NetR6_1: R6.1 U3.5(EN)
NetR13_1: R13.1 U3.6(FB)

### Notes on the sheet
- Vref: R1= ((Vout - Vref)/Vref)*R2
  R1 = 52,3K 1%
  R2 = 10K 1%
  Vref:
  Min = 789mV  ---> Vout = 4.92V
  Typ = 805mv  ---> Vout = 5.02V
  Max = 821mV  ---> Vout = 5.11V
- Input Voltage Range: 4.2V to 17V
- Title
- Project
- Size:
- Author
- A4
- Number:
- Revision:
- Mundo Reader, S.L. This project and all the sheets and layouts enclosed are licensed under Creative Commons by Attribution and Share Alike [CC BY-SA] (www.creativecommons.com)
- Date:
- Time:
- Sheet
- of

### Library data of the parts
C15 = CMP-A0371-1: Manufacturer: Kemet; Dielectric: X5R; Value: 1uF ±10% 25V; OrderingCode: C0603C105K3PAC; Temp_ Max: 125; Temp_ Min: -55; SchLibComponentName: Capacitor; Part Number: C0603_1uF_25V_±10%; Price units: EUR
C16 C27 C28 = CMP-A0110-1: Manufacturer: Murata; SchLibComponentName: Capacitor; Value: 22uF ±10% 25V; Tolerance: ±10%; OrderingCode: GRM31CR61E226KE15L; Temp_ Max: 85; Temp_ Min: -55; Part Number: C1206_22uF_25V_±10%; Price units: EUR
C26 = CMP-00257-1: as C1 on sheet ATMega328; Manufacturer 2: AVX; Part Number: C0603_100nF_50V_±10%_X7R; Price units: EUR
C34 = CMP-A0543-2: Manufacturer: Kemet; Dielectric: C0G; Value: 15pF ±10% 16V; OrderingCode: C0402C150K4GAC; Temp_ Max: 125; Temp_ Min: -55; Description ES: Condensador; SchLibComponentName: Capacitor; Part Number: C0402_15pF_16V_±10%; Price units: EUR
L3 = CMP-A0670-2: Semi-shielded power inductor; Manufacturer: Bourns; L: 2,2µH; Rdc: 0,013R; Current: 6,3A; Current Sat#: 7,3A; OrderingCode: SRN8040-2R2Y; Temp_ Max: 105; Temp_ Min: -40; Value: 2,2µH 6,3A; AccessRights: 2147483647; ContentType: Component; Current Sat.: 7,4A; Description ES: Bobina; Folder: Components Library\Pasives\Inductor_SMD\Power Inductor$\; RevisionId: 1; SchLibComponentName: Inductor; Part Number: 2,2uH_6,3A; Price units: EUR; ContentTypeGUID: CB3C11C4-E317-11DF-B822-12313F0024A2; FolderGUID: 60894C29-593F-4616-8F9E-CDB5863F0F96; ItemGUID: EAB2D04B-E49E-443A-801C-32E206E8EAE6; ItemHRID: CMP-A0670; LifeCycle: New From Design; LifeCycleStateGUID: 706004B5-C76E-482E-903B-BA0E4FAE086A; ReleaseDate: 19/02/2016 11:18:53 AM
R3 = CMP-A1838-2: Manufacturer: Vishay; Value: '=Resistance+' '+Tolerance+' '+Power; OrderingCode: CRCW040210R0FK; Power: 0.063W; Temp_ Max: 155; Temp_ Min: -55; Description ES: Resistencia; OrderingCode 2: RC0402FR-0710RL; Temp_Max: 155°C; Temp_Min: -55°C; SchLibComponentName: Resistor; PackageDescription: SMD; Part Number: R0402_10R_0.063W_±1%; Price units: EUR; Manufacturer 2: Yageo
R6 = CMP-A1835-2: Manufacturer: Vishay; Value: 100k ±1% 0.063W; OrderingCode: CRCW0402100KFK; Power: 0.063W; Description ES: Resistencia; Temp_ Max: 155; Temp_ Min: -55; SchLibComponentName: Resistor; PackageDescription: SMD; Part Number: R0402_100k_0.063W_±1%; Price units: EUR
R9 = CMP-A1961-1: as R14 on sheet ZUM_Core_Power; SchLibComponentName: Resistor; PackageDescription: SMD; Part Number: R0402_52,3k_0.063W_±1%; Price units: EUR
R13 = CMP-A1985-2: Manufacturer: Vishay; Value: 75k ±1% 0.063W; OrderingCode: CRCW040275K0FK; Power: 0.063W; Temp_ Max: 155; Temp_ Min: -55; Description ES: Resistencia; OrderingCode 2: RC0402FR-0775KL; Temp_Max: 155°C; Temp_Min: -55°C; SchLibComponentName: Resistor; PackageDescription: SMD; Part Number: R0402_75k_0.063W_±1%; Price units: EUR; Manufacturer 2: Yageo
R17 = CMP-A1692-4: Manufacturer: Vishay; Value: 10k ±5% 0.063W; SchLibComponentName: Resistor; OrderingCode: CRCW040210K0JN; Power: 0.063W; Temp_ Max: 155; Temp_ Min: -55; Description ES: Resistencia; OrderingCode 2: RC0402JR-0710KL; Temp_Max: 155°C; Temp_Min: -55°C; PackageDescription: SMD; Part Number: R0402_10k_0.063W_±5%; Price units: EUR; Manufacturer 2: Yageo
TP8 = CMP-A2499-3: as TP1 on sheet USB_CP2104; SchLibComponentName: Testpoint; Part Number: TP_POWER; Price units: EUR
U3 = CMP-00385-3: DCDC Step Down Vout= 1-5V; Vin= 12-17V; Manufacturer: MPS; Description ES: Regulador de voltaje; OrderingCode: MP1477GTF-Z; Temp_Max: 125; Temp_Min: -40; Part Number: MP1477GTF-Z; Price units: EUR

## Sheet MP2019_LDO_5V.SchDoc: MP2019_LDO_5V@300mA
size A4; Author: Andrés Gullón; DocumentNumber: 3; SheetNumber: 3; SheetTotal: 9
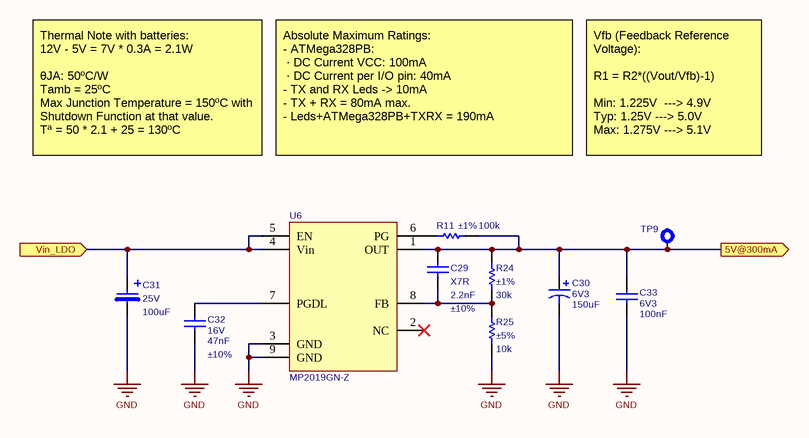
[diagram p5: MP2019_LDO_5V.SchDoc]

### Parts
C29  Dielectric: X7R  Capacitance: 2.2nF  Tolerance: ±10%  [C0402]  (hidden comment: C0402_2.2nF_16V_±10%)
C30  Voltage: 6V3  Capacitance: 150uF  [CASE_B_3528-1411]  (hidden comment: 150uF_6V3_±20%)
C31  Voltage: 25V  Capacitance: 100uF  [CASE_D_7.7]  (hidden comment: Cap_Al_100uF_25V)
C32  Voltage: 16V  Capacitance: 47nF  Tolerance: ±10%  [C0402]  (hidden comment: C0402_47nF_16V_±10%)
C33  Voltage: 6V3  Capacitance: 100nF  [C0402]  (hidden comment: C0402_100nF_6V3_±10%)
R11  Tolerance: ±1%  Resistance: 100k  [R0402]  (hidden comment: R0402_100k_0.063W_±1%)
R24  Tolerance: ±1%  Resistance: 30k  [R0402]  (hidden comment: R0402_30k_0.063W_±1%)
R25  Tolerance: ±5%  Resistance: 10k  [R0402]  (hidden comment: R0402_10k_0.063W_±5%)
TP9  TP  [TP_POWER]  (value not drawn)  (no BOM)
U6  MP2019GN-Z  [SOIC8 EP]

### Ports
5V@300mA (out), Vin_LDO (in)

### Nets
5V@300mA: C29.1 C30.1 C33.2 R11.1 R24.2 TP9.1 U6.1(OUT) ; port 5V@300mA
GND: C30.2 C31.2 C32.1 C33.1 R25.2 U6.3(GND) U6.9(GND)
NetC29_2: C29.2 R24.1 R25.1 U6.8(FB)
NetC31_1: C31.1 U6.4(Vin) U6.5(EN) ; port Vin_LDO
NetC32_2: C32.2 U6.7(PGDL)
NetR11_2: R11.2 U6.6(PG)

Not connected (* = marked no-connect by the designer): U6 2(NC)*

### Notes on the sheet
- Thermal Note with batteries:
  12V - 5V = 7V * 0.3A = 2.1W
  θJA: 50ºC/W
  Tamb = 25ºC
  Max Junction Temperature = 150ºC with Shutdown Function at that value.
  Tª = 50 * 2.1 + 25 = 130ºC
- Absolute Maximum Ratings:
  - ATMega328PB:
  · DC Current VCC: 100mA
  · DC Current per I/O pin: 40mA
  - TX and RX Leds -> 10mA
  - TX + RX = 80mA max.
  - Leds+ATMega328PB+TXRX = 190mA
- Vfb (Feedback Reference Voltage):
  R1 = R2*((Vout/Vfb)-1)
  Min: 1.225V  ---> 4.9V
  Typ: 1.25V ---> 5.0V
  Max: 1.275V ---> 5.1V
- Title
- Project
- Size:
- Author
- A4
- Number:
- Revision:
- Mundo Reader, S.L. This project and all the sheets and layouts enclosed are licensed under Creative Commons by Attribution and Share Alike [CC BY-SA] (www.creativecommons.com)
- Date:
- Time:
- Sheet
- of

### Library data of the parts
C29 = CMP-A0549-1: Manufacturer: Kemet; Voltage: 16V; Value: 2.2nF ±10% 16V; OrderingCode: C0402C222K4RAC; Temp_ Max: 125; Temp_ Min: -55; SchLibComponentName: Capacitor; Part Number: C0402_2.2nF_16V_±10%; Price units: EUR
C30 = CMP-A2028-1: Manufacturer: Vishay; Value: 150uF ±20% 6V3; Tolerance: ±20%; ESR: 40m; OrderingCode: T55B157M6R3C0040; Temp_ Max: 105; Temp_ Min: -55; SchLibComponentName: Tantalum; Part Number: 150uF_6V3_±20%; Price units: EUR
C31 = CMP-A0618-1: Manufacturer: Panasonic; Value: 100uF 25V; OrderingCode: EEE-HA1E101XP; Temp_ Max: 85; Temp_ Min: -40; SchLibComponentName: Electrolytic; Part Number: Cap_Al_100uF_25V; Price units: EUR
C32 = CMP-A0571-1: Manufacturer: Kemet; Dielectric: X7R; Value: 47nF ±10% 16V; OrderingCode: C0402C473K4RAC; Temp_ Max: 125; Temp_ Min: -55; SchLibComponentName: Capacitor; Part Number: C0402_47nF_16V_±10%; Price units: EUR
C33 = CMP-A0475-1: Manufacturer: Kemet; Dielectric: X7R; Value: 100nF ±10% 6V3; Tolerance: ±10%; OrderingCode: C0402C104K9RAC; Temp_ Max: 125; Temp_ Min: -55; SchLibComponentName: Capacitor; Part Number: C0402_100nF_6V3_±10%; Price units: EUR
R11 = CMP-A1835-1: Manufacturer: Vishay; Value: 100k ±1% 0.063W; OrderingCode: CRCW0402100KFK; Power: 0.063W; Temp_ Max: 155; Temp_ Min: -55; SchLibComponentName: Resistor; PackageDescription: SMD; Part Number: R0402_100k_0.063W_±1%; Price units: EUR
R24 = CMP-A1912-2: Manufacturer: Vishay; Value: 30k ±1% 0.063W; OrderingCode: CRCW040230K0FK; Power: 0.063W; Temp_ Max: 155; Temp_ Min: -55; Description ES: Resistencia; SchLibComponentName: Resistor; PackageDescription: SMD; Part Number: R0402_30k_0.063W_±1%; Price units: EUR
R25 = CMP-A1692-4: as R17 on sheet MP1477H_DCDC_5V; PackageDescription: SMD; Part Number: R0402_10k_0.063W_±5%; Price units: EUR; Manufacturer 2: Yageo
TP9 = CMP-A2499-3: as TP1 on sheet USB_CP2104; SchLibComponentName: Testpoint; Part Number: TP_POWER; Price units: EUR
U6 = CMP-00392-2: LDO Vin: 3-40V Vout: 1.2-15V @300mA; Manufacturer: Monolithic Power Systems; Temp_Max: 150; Temp_Min: -40; Description ES: LDO Vin: 3-40V Vout: 1.2-15V @300mA; OrderingCode: MP2019GN-Z; Part Number: MP2019GN-Z; SchLibComponentName: MP2019

## Sheet ZUM_Core_USB_BT.SchDoc: ZUM Core USB BT
size A4; Author: Andrés Gullón; DocumentNumber: 7; SheetNumber: 7; SheetTotal: 9
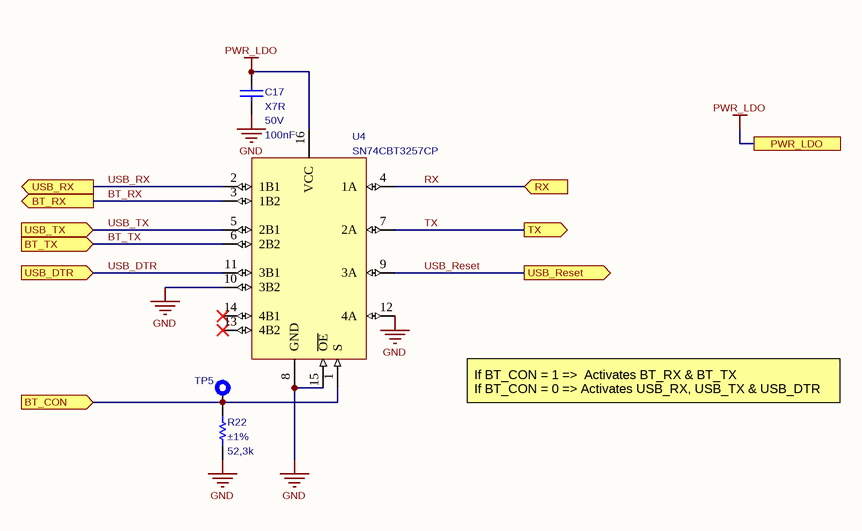
[diagram p6: ZUM_Core_USB_BT.SchDoc]

### Parts
C17  Dielectric: X7R  Voltage: 50V  Capacitance: 100nF  [C0603]  (hidden comment: C0603_100nF_50V_±10%_X7R)
R22  Tolerance: ±1%  Resistance: 52,3k  [R0402]  (hidden comment: R0402_52,3k_0.063W_±1%)
TP5  TP  [TP_POWER]  (value not drawn)  (no BOM)
U4  SN74CBT3257CP  [TSSOP16]

### Ports
BT_CON (in), BT_RX (out), BT_TX (in), PWR_LDO, RX (in), TX (out), USB_DTR (in), USB_Reset (out), USB_RX (out), USB_TX (in)

### Nets
GND: C17.1 R22.2 U4.8(GND) U4.10(3B2) U4.12(4A) U4.15(~{OE})
PWR_LDO: C17.2 U4.16(VCC) ; port PWR_LDO
BT_RX: U4.3(1B2) ; port BT_RX
BT_TX: U4.6(2B2) ; port BT_TX
RX: U4.4(1A) ; port RX  [project net D1]
TX: U4.7(2A) ; port TX  [project net D0]
USB_DTR: U4.11(3B1) ; port USB_DTR  [project net USB_~{DTR}]
USB_Reset: U4.9(3A) ; port USB_Reset
USB_RX: U4.2(1B1) ; port USB_RX
USB_TX: U4.5(2B1) ; port USB_TX
NetR22_1: R22.1 TP5.1 U4.1(S) ; port BT_CON

Not connected (* = marked no-connect by the designer): U4 13(4B2)* 14(4B1)*

### Notes on the sheet
- If BT_CON = 1 =>  Activates BT_RX & BT_TX
  If BT_CON = 0 => Activates USB_RX, USB_TX & USB_DTR
- Title
- Project
- Size:
- Author
- A4
- Number:
- Revision:
- Mundo Reader, S.L. This project and all the sheets and layouts enclosed are licensed under Creative Commons by Attribution and Share Alike [CC BY-SA] (www.creativecommons.com)
- Date:
- Time:
- Sheet
- of

### Library data of the parts
C17 = CMP-00257-1: as C1 on sheet ATMega328; Manufacturer 2: AVX; Part Number: C0603_100nF_50V_±10%_X7R; Price units: EUR
R22 = CMP-A1961-1: as R14 on sheet ZUM_Core_Power; SchLibComponentName: Resistor; PackageDescription: SMD; Part Number: R0402_52,3k_0.063W_±1%; Price units: EUR
TP5 = CMP-A2499-3: as TP1 on sheet USB_CP2104; SchLibComponentName: Testpoint; Part Number: TP_POWER; Price units: EUR
U4 = CMP-A2334-1: Multiplexer; Manufacturer: Texas Instruments; OrderingCode: SN74CBT3257CPWR; Description ES: Multiplexador; Temp_ Max: 85; Temp_ Min: -40; Lead time: 6 wks; SchLibComponentName: SN74CBT3257; Part Number: SN74CBT3257CP; Supplier: Silica; Supplier cod: AC1190; Price: 0,192; Price units: EUR; HelpURL: https://openkm-usa.bq.com/OpenKM/index.jsp?uuid=ee2e39d9-8b20-4e62-b4a8-b54acf89f69a

## Sheet ZUM_Core_Autoreset.SchDoc: ZUM Core Autoreset
size A4; Author: Andrés Gullón; DocumentNumber: 9; SheetNumber: 9; SheetTotal: 9
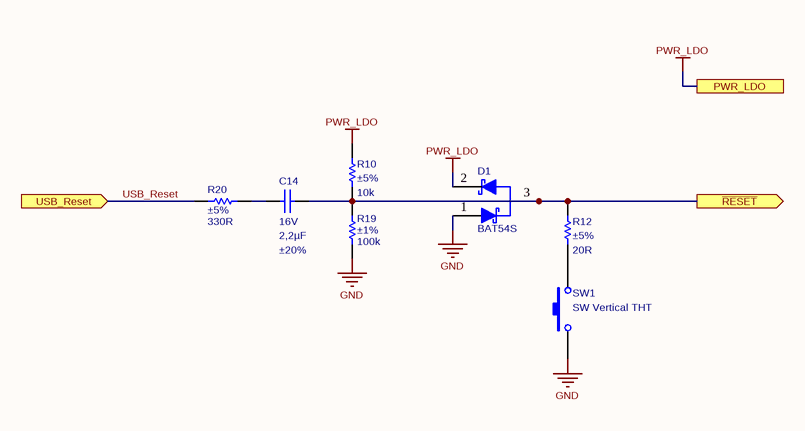
[diagram p7: ZUM_Core_Autoreset.SchDoc]

### Parts
C14  Voltage: 16V  Capacitance: 2,2µF  Tolerance: ±20%  [C0402]  (hidden comment: C0402_2.2uF_16V_±20%)
D1  BAT54S  [SOT23-3]
R10  Tolerance: ±5%  Resistance: 10k  [R0402]  (hidden comment: R0402_10k_0.063W_±5%)
R12  Tolerance: ±5%  Resistance: 20R  [R0402]  (hidden comment: R0402_20R_0.063W_±5%)
R19  Tolerance: ±1%  Resistance: 100k  [R0402]  (hidden comment: R0402_100k_0.063W_±1%)
R20  Tolerance: ±5%  Resistance: 330R  [R0402]  (hidden comment: R0402_330R_0.063W_±5%)
SW1  SW Vertical THT  [SW_Vert_THT_7.5x6x6.5]

### Ports
PWR_LDO, USB_Reset (in), ~{RESET} (out)

### Nets
GND: D1.1(A) R19.2 SW1.1
PWR_LDO: D1.2(K2) R10.1 ; port PWR_LDO
~{MCU_RES}: C14.1 D1.3(K1) R10.2 R12.2 R19.1 ; port ~{RESET}
USB_Reset: R20.2 ; port USB_Reset
NetC14_2: C14.2 R20.1
NetR12_1: R12.1 SW1.2

### Notes on the sheet
- Title
- Project
- Size:
- Author
- A4
- Number:
- Revision:
- Mundo Reader, S.L. This project and all the sheets and layouts enclosed are licensed under Creative Commons by Attribution and Share Alike [CC BY-SA] (www.creativecommons.com)
- Date:
- Time:
- Sheet
- of

### Library data of the parts
C14 = CMP-A0550-4: as C3 on sheet ATMega328; SchLibComponentName: Capacitor; Price units: EUR; ComponentType: Capacitor; ContentTypeGUID: CB3C11C4-E317-11DF-B822-12313F0024A2; FolderGUID: B1BE7916-43F7-4918-A273-F24409A7170B; ItemGUID: BD471B44-C1FF-4F80-85CC-AC0CC62DE9EE; ItemHRID: CMP-A0550; LifeCycle: New From Design; LifeCycleStateGUID: 706004B5-C76E-482E-903B-BA0E4FAE086A; Manufacturer 2: Taiyo Yuden; ReleaseDate: 04/09/2017 08:02:11 AM
D1 = CMP-A2299-1: Schottky Diode; Manufacturer: NXP; SchLibComponentName: Dual Schottky; Ifor: 200mA; Vrrm: 30V; Ifsm: 600mA; Vf: 0,8V; Description ES: Diodo Schottky; Temp_Max: 150; Temp_Min: -55; Value: 200mA 30V; Part Number: BAT54S; OrderingCode: BAT54S; Supplier cod: AC1190; Price units: EUR; Manufacturer 2: Vishay; OrderingCode 2: BAT54S
R10 = CMP-A1692-4: as R17 on sheet MP1477H_DCDC_5V; PackageDescription: SMD; Part Number: R0402_10k_0.063W_±5%; Price units: EUR; Manufacturer 2: Yageo
R12 = CMP-A1736-5: Manufacturer: Vishay; OrderingCode: CRCW040220R0JN; Power: 0.063W; Value: 20R ±5% 0.063W; Temp_ Max: 155; Temp_ Min: -55; Description ES: Resistencia; SchLibComponentName: Resistor; PackageDescription: SMD; Part Number: R0402_20R_0.063W_±5%; Price units: EUR
R19 = CMP-A1835-1: as R11 on sheet MP2019_LDO_5V; SchLibComponentName: Resistor; PackageDescription: SMD; Part Number: R0402_100k_0.063W_±1%; Price units: EUR
R20 = CMP-A1762-2: as R8 on sheet ZUM_Core; PackageDescription: SMD; Part Number: R0402_330R_0.063W_±5%; Price units: EUR
SW1 = CMP-A2468-2: Switch; Manufacturer: C&K Components; OrderingCode: PTS645VL39-2 LFS; Description ES: Pulsador; Temp_ Max: 60; Temp_ Min: -20; Lead time: 11 wks; SchLibComponentName: Switch; Part Number: SW Vertical THT; Price units: EUR